# EAGLE schematic main-fuse-harness (EAGLE 6.4)
Main fuse relocation harness for Yamaha XVZ1300TF Also works with all other motorcycles using a 4-way .250" female spade connector going into the starter relay
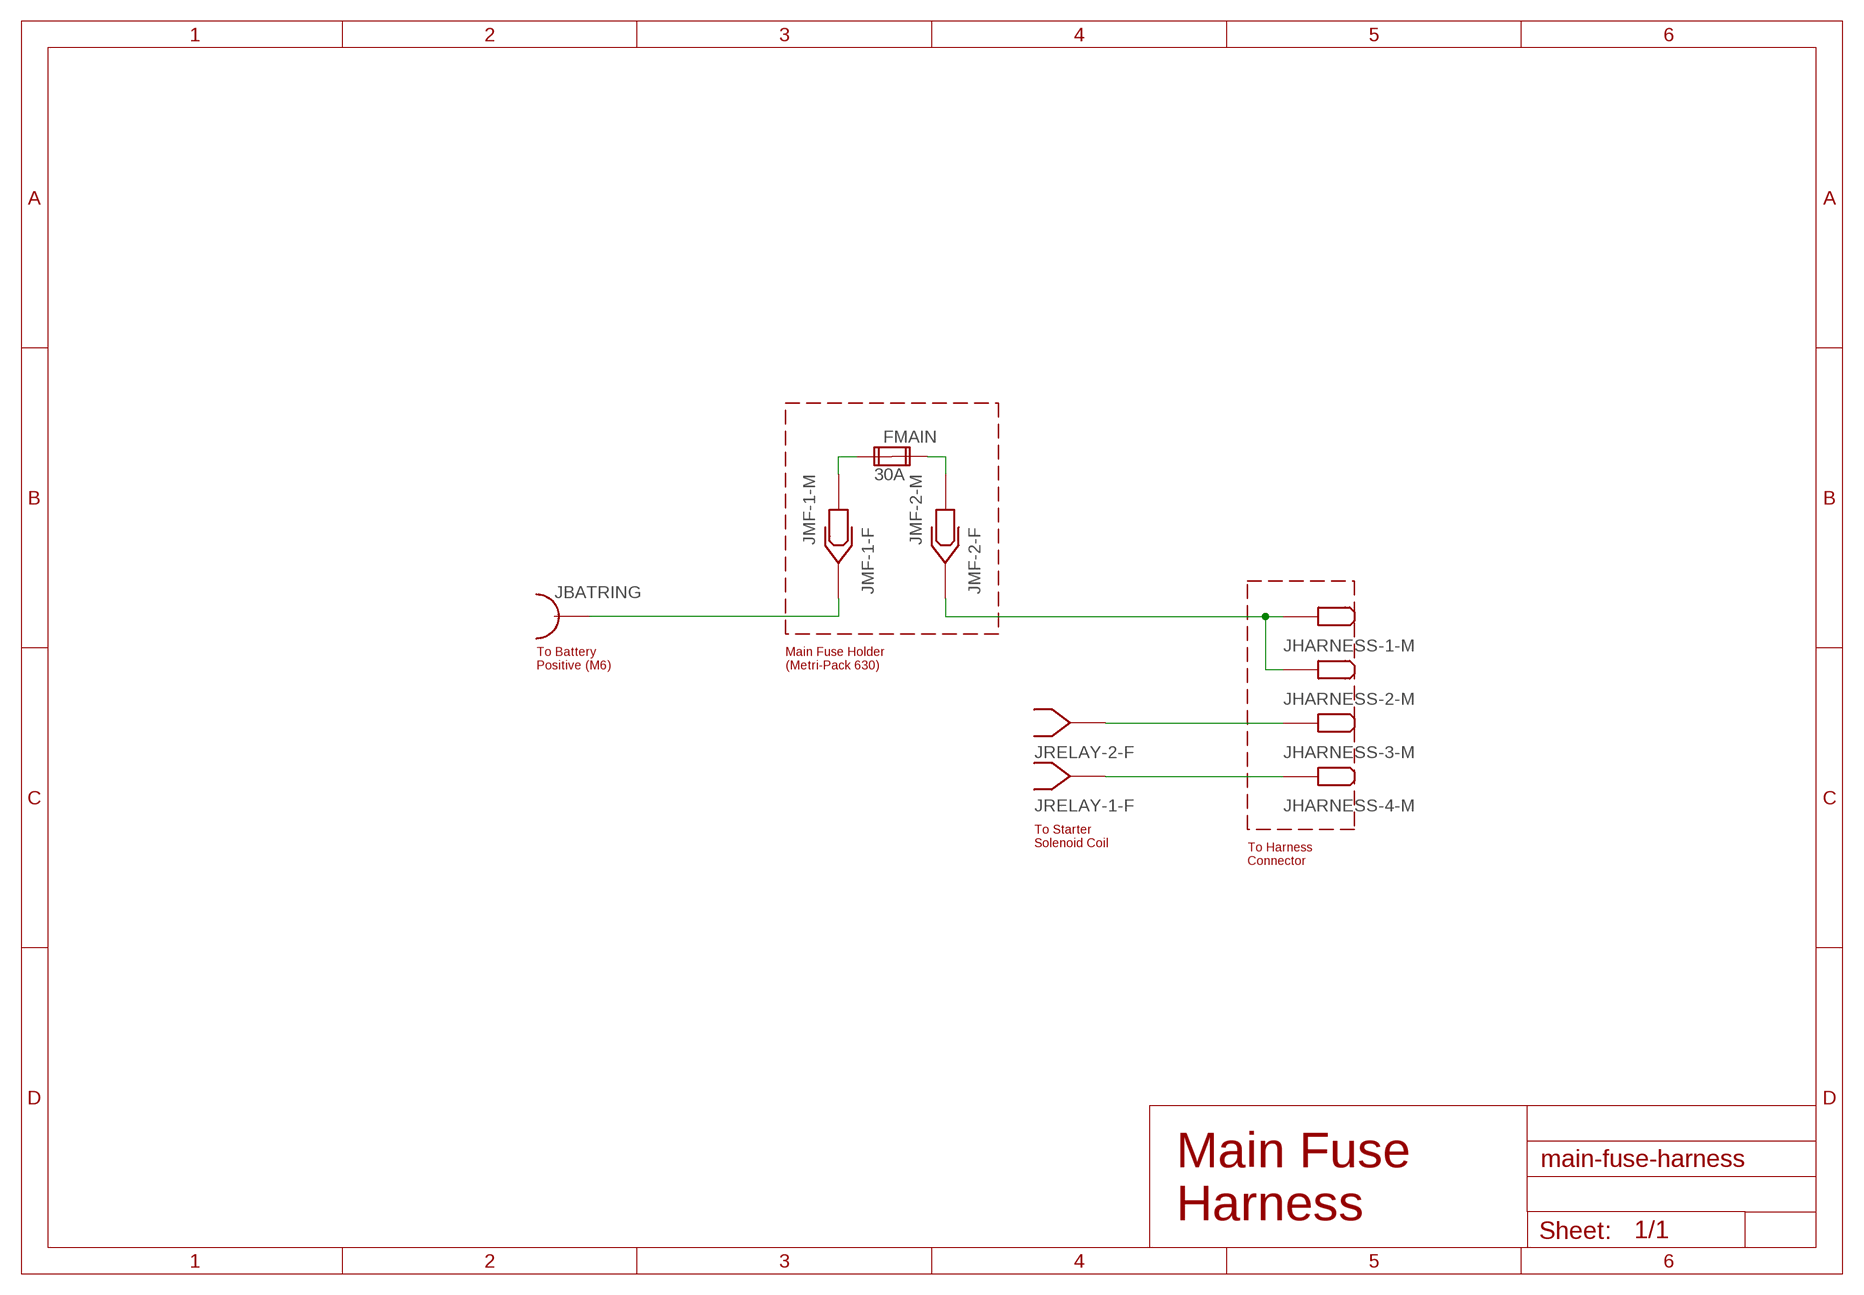
[diagram p0: schematic, sheet 1]

## Parts
FMAIN  30A  FUSE2P  [FUSE1]

## Nets
P$1: FMAIN.1A FMAIN.2A ; supply symbol labelled SPADE_2WAY, SPADE_4WAY
Unconnected: FMAIN.1B FMAIN.2B

## Notes on the sheet
- To Battery
  Positive (M6)
- Main Fuse Holder
  (Metri-Pack 630)
- To Starter
  Solenoid Coil
- To Harness
  Connector
- Main Fuse
  Harness

## Library data of the parts
FMAIN = special:FUSE2P: FUSE 5 x 20 mm